# Altium schematic sheet di.SchDoc
size A2
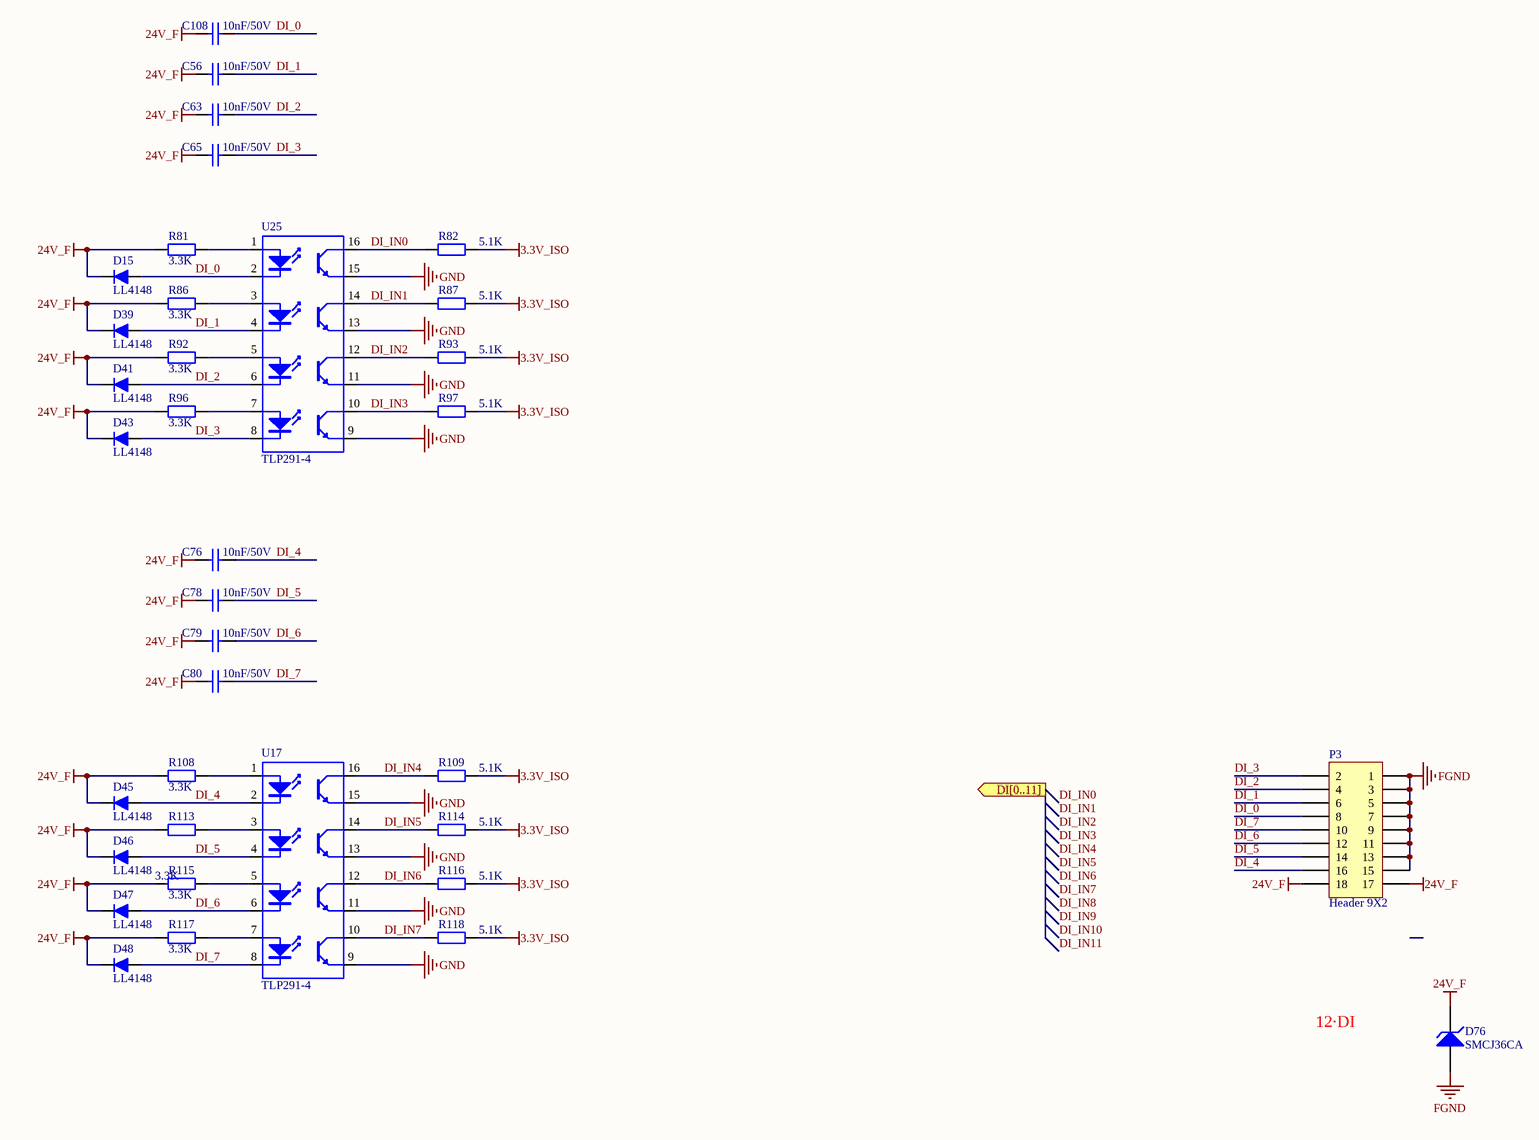
[diagram p0: di.SchDoc]

## Parts
C56  10nF/50V  [0603C]
C63  10nF/50V  [0603C]
C65  10nF/50V  [0603C]
C76  10nF/50V  [0603C]
C78  10nF/50V  [0603C]
C79  10nF/50V  [0603C]
C80  10nF/50V  [0603C]
C108  10nF/50V  [0603C]
D15  LL4148  [DO-213AB/LL34/MiniMELF]
D39  LL4148  [DO-213AB/LL34/MiniMELF]
D41  LL4148  [DO-213AB/LL34/MiniMELF]
D43  LL4148  [DO-213AB/LL34/MiniMELF]
D45  LL4148  [DO-213AB/LL34/MiniMELF]
D46  LL4148  [DO-213AB/LL34/MiniMELF]
D47  LL4148  [DO-213AB/LL34/MiniMELF]
D48  LL4148  [DO-213AB/LL34/MiniMELF]
D76  SMCJ36CA  [smc]
P3  Header 9X2  [XH2.54_2x9]
R81  3.3K  [0603R]
R82  5.1K  [0603R]
R86  3.3K  [0603R]
R87  5.1K  [0603R]
R92  3.3K  [0603R]
R93  5.1K  [0603R]
R96  3.3K  [0603R]
R97  5.1K  [0603R]
R108  3.3K  [0603R]
R109  5.1K  [0603R]
R113  3.3K  [0603R]
R114  5.1K  [0603R]
R115  3.3K  [0603R]
R116  5.1K  [0603R]
R117  3.3K  [0603R]
R118  5.1K  [0603R]
U17  TLP291-4  [SOP16-T]
U25  TLP291-4  [SOP16-T]

## Ports
DI[0..11] (out)

## Nets
3.3V_ISO: R82.1 R87.1 R93.1 R97.1 R109.1 R114.1 R116.1 R118.1
24V_F: C56.1 C63.1 C65.1 C76.1 C78.1 C79.1 C80.1 C108.1 D15.2(K) D39.2(K) D41.2(K) D43.2(K) D45.2(K) D46.2(K) D47.2(K) D48.2(K) D76.2(K) P3.17 P3.18 R81.2 R86.2 R92.2 R96.2 R108.2 R113.2 R115.2 R117.2
FGND: D76.1(A) P3.1 P3.3 P3.5 P3.7 P3.9 P3.11 P3.13 P3.15
GND: U17.9(E) U17.11(E) U17.13(E) U17.15(E) U25.9(E) U25.11(E) U25.13(E) U25.15(E)
DI_0: C108.2 D15.1(A) P3.8 U25.2(K)
DI_1: C56.2 D39.1(A) P3.6 U25.4(K)
DI_2: C63.2 D41.1(A) P3.4 U25.6(K)
DI_3: C65.2 D43.1(A) P3.2 U25.8(K)
DI_4: C76.2 D45.1(A) P3.16 U17.2(K)
DI_5: C78.2 D46.1(A) P3.14 U17.4(K)
DI_6: C79.2 D47.1(A) P3.12 U17.6(K)
DI_7: C80.2 D48.1(A) P3.10 U17.8(K)
DI_IN0: R82.2 U25.16(C)
DI_IN1: R87.2 U25.14(C)
DI_IN2: R93.2 U25.12(C)
DI_IN3: R97.2 U25.10(C)
DI_IN4: R109.2 U17.16(C)
DI_IN5: R114.2 U17.14(C)
DI_IN6: R116.2 U17.12(C)
DI_IN7: R118.2 U17.10(C)
NetR81_1: R81.1 U25.1(A)
NetR86_1: R86.1 U25.3(A)
NetR92_1: R92.1 U25.5(A)
NetR96_1: R96.1 U25.7(A)
NetR108_1: R108.1 U17.1(A)
NetR113_1: R113.1 U17.3(A)
NetR115_1: R115.1 U17.5(A)
NetR117_1: R117.1 U17.7(A)

## Notes on the sheet
- 12·DI
- Labels drawn without touching a wire or pin: DI_IN0, DI_IN1, DI_IN2, DI_IN3, DI_IN4, DI_IN5, DI_IN6, DI_IN7, DI_IN8, DI_IN9, DI_IN10, DI_IN11

## Library data of the parts
C56 C63 C65 C76 C78-C80 C108 = Cap: Capacitor; Value: 22nF; Published: 8-Jun-2000; LatestRevisionDate: 17-Jul-2002; LatestRevisionNote: Re-released for DXP Platform.; PackageReference: RAD-0.3; Publisher: Altium Limited; PackageDescription: Radial Cap, Thru-Hole; 2 Leads; 0.3 in Pin Spacing
D15 D39 D41 D43 D45-D48 = LL4148: VISHAY,LL4148,圆柱体MiniMELF100V/2A,ROHS; 版本: V1.00; 名称: 快速开关二极管; 物料编号: APLLY; 制造商: VISHAY
D76 = D Zener: SMBJ36CA; Published: 8-Jun-2000; LatestRevisionDate: 17-Jul-2002; LatestRevisionNote: Re-released for DXP Platform.; PackageReference: DIODE-0.7; Publisher: Altium Limited
P3 = Header 9X2: Header, 9-Pin, Dual row; LatestRevisionDate: 17-Jul-2002; LatestRevisionNote: Re-released for DXP Platform.; Publisher: Altium Limited
R81 R82 R86 R87 R92 R93 R96 R97 R108 R109 R113-R118 = Res0805M
U17 U25 = TLP281-4